# EAGLE design Lightpack_6.0T_man (EAGLE 6.5.0)
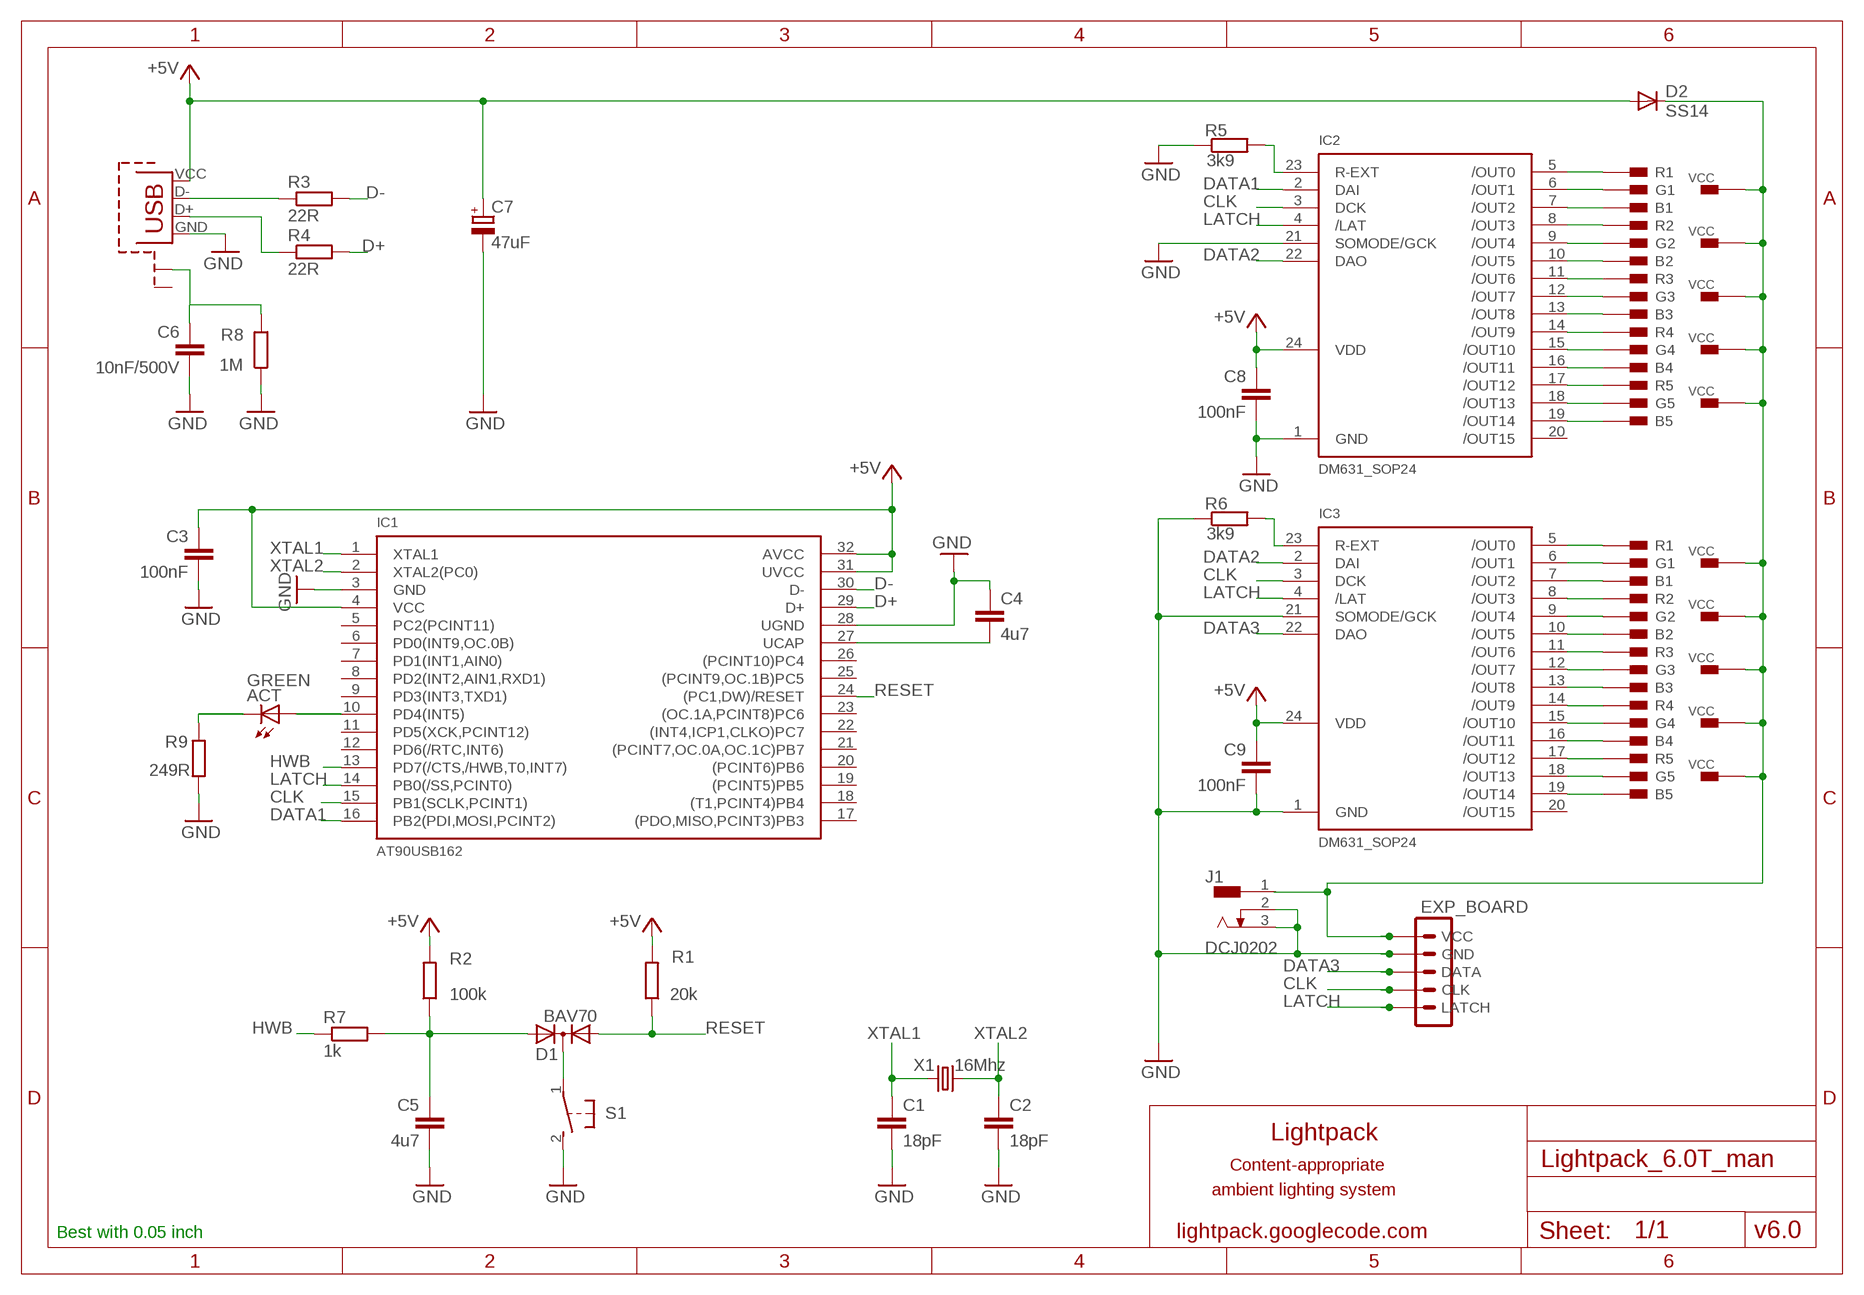
[diagram p0: schematic, sheet 1]

## Parts
ACT  GREEN  LED3MM  [LED3MM]
C1  18pF  C-EUC0805  [C0805]
C2  18pF  C-EUC0805  [C0805]
C3  100nF  C-EUC0805  [C0805]
C4  4u7  C-EUC0805  [C0805]
C5  4u7  C-EUC0805  [C0805]
C6  10nF/500V  C-EUC0805  [C0805]
C7  47uF  CPOL-EUSMCD  [SMC_D]
C8  100nF  C-EUC0805  [C0805]
C9  100nF  C-EUC0805  [C0805]
CN1  USB-MICRO-B-EVT  [USB-MICRO-B-UNIVERSAL-SOLID-FOOTS]
CN2  RJ11-5P-REEL-LIGHTPACK6T2  [RJ11-1XN-5P]
CN3  RJ11-5P-REEL-MAIN  [RJ11-1XN-5P]
D1  BAV70  DIODE-2AC|CASOT23  [SOT23]
D2  SS14  DIODE-SMB  [SMB]
EXP_BOARD  MA05-1  [MA05-1]
IC1  AT90USB162  [TQFP32]
IC2  DM631_SOP24  [SOP24-300-1.27]
IC3  DM631_SOP24  [SOP24-300-1.27]
J1  DCJ0202  [DCJ0202]
R1  20k  R-EU_R0805  [R0805]
R2  100k  R-EU_R0805  [R0805]
R3  22R  R-EU_R0805  [R0805]
R4  22R  R-EU_R0805  [R0805]
R5  3k9  R-EU_R0805  [R0805]
R6  3k9  R-EU_R0805  [R0805]
R7  1k  R-EU_R0805  [R0805]
R8  1M  R-EU_R0805  [R0805]
R9  249R  R-EU_R0805  [R0805]
S1  31-XX  [B3F-31XX]
X1  16Mhz  CRYSTALHC49UP  [HC49UP]

## Nets
+5V [VCC]: C3.1 C7.+ C8.1 C9.1 CN1.VCC(VBUS) D2.A IC1.4(VCC) IC1.31(UVCC) IC1.32(AVCC) IC2.24(VDD) IC3.24(VDD) R1.2 R2.2
CLK: EXP_BOARD.2(CLK) IC1.15(PB1(SCLK,PCINT1)) IC2.3(DCK) IC3.3(DCK)
D+: IC1.29(D+) R4.2
D-: IC1.30(D-) R3.2
DATA1: IC1.16(PB2(PDI,MOSI,PCINT2)) IC2.2(DAI)
DATA2: IC2.22(DAO) IC3.2(DAI)
DATA3: EXP_BOARD.3(DATA) IC3.22(DAO)
GND: C1.2 C2.2 C3.2 C4.1 C5.2 C6.1 C7.- C8.2 C9.2 CN1.GND EXP_BOARD.4(GND) IC1.3(GND) IC1.28(UGND) IC2.1(GND) IC2.21(SOMODE/GCK) IC3.1(GND) IC3.21(SOMODE/GCK) J1.2 J1.3 R5.1 R6.1 R8.1 R9.1 S1.2(S)
HWB: IC1.13(PD7(/CTS,/HWB,T0,INT7)) R7.1
LATCH: EXP_BOARD.1(LATCH) IC1.14(PB0(/SS,PCINT0)) IC2.4(/LAT) IC3.4(/LAT)
N$1: IC2.23(R-EXT) R5.2
N$2: CN3.R2 IC3.8(/OUT3)
N$3: ACT.A IC1.10(PD4(INT5))
N$5: CN2.R5(R1) IC2.5(/OUT0)
N$6: CN2.G5(G1) IC2.6(/OUT1)
N$7: CN2.B5(B1) IC2.7(/OUT2)
N$9: CN2.R4(R2) IC2.8(/OUT3)
N$10: CN2.G4(G2) IC2.9(/OUT4)
N$11: CN2.B4(B2) IC2.10(/OUT5)
N$12: CN2.R1(R3) IC2.11(/OUT6)
N$13: CN2.G1(G3) IC2.12(/OUT7)
N$14: CN2.B1(B3) IC2.13(/OUT8)
N$15: CN2.R2(R4) IC2.14(/OUT9)
N$16: D1.3(C) S1.1(P)
N$17: C4.2 IC1.27(UCAP)
N$18: CN3.R1 IC3.5(/OUT0)
N$19: CN3.G1 IC3.6(/OUT1)
N$20: CN3.B1 IC3.7(/OUT2)
N$21: CN3.G2 IC3.9(/OUT4)
N$22: CN3.B2 IC3.10(/OUT5)
N$23: CN3.R3 IC3.11(/OUT6)
N$24: CN3.G3 IC3.12(/OUT7)
N$25: CN3.R4 IC3.14(/OUT9)
N$26: CN3.B3 IC3.13(/OUT8)
N$27: CN3.G4 IC3.15(/OUT10)
N$28: CN3.B4 IC3.16(/OUT11)
N$29: CN2.G2(G4) IC2.15(/OUT10)
N$30: CN2.B2(B4) IC2.16(/OUT11)
N$31: IC3.23(R-EXT) R6.2
N$32: CN1.D- R3.1
N$33: CN1.D+ R4.1
N$37: ACT.K(C) R9.2
N$38: CN2.R3(R5) IC2.17(/OUT12)
N$39: CN2.G3(G5) IC2.18(/OUT13)
N$40: CN2.B3(B5) IC2.19(/OUT14)
N$41: CN3.R5 IC3.17(/OUT12)
N$42: CN3.G5 IC3.18(/OUT13)
N$43: CN3.B5 IC3.19(/OUT14)
N$44: C6.2 CN1.P$4(SHIELD1) R8.2
N$47: C5.1 D1.2(A2) R2.1 R7.2
N$57 [VCC]: CN2.VCC1(VCC3) CN2.VCC2(VCC4) CN2.VCC3(VCC5) CN2.VCC4(VCC2) CN2.VCC5(VCC1) CN3.VCC1 CN3.VCC2 CN3.VCC3 CN3.VCC4 CN3.VCC5 D2.C EXP_BOARD.5(VCC) J1.1
RESET: D1.1(A1) IC1.24((PC1,DW)/RESET) R1.1
XTAL1: C1.1 IC1.1(XTAL1) X1.1
XTAL2: C2.1 IC1.2(XTAL2(PC0)) X1.2
Unconnected: CN1.P$1(SHIELD2) IC1.5(PC2(PCINT11)) IC1.6(PD0(INT9,OC.0B)) IC1.7(PD1(INT1,AIN0)) IC1.8(PD2(INT2,AIN1,RXD1)) IC1.9(PD3(INT3,TXD1)) IC1.11(PD5(XCK,PCINT12)) IC1.12(PD6(/RTC,INT6)) IC1.17((PDO,MISO,PCINT3)PB3) IC1.18((T1,PCINT4)PB4) IC1.19((PCINT5)PB5) IC1.20((PCINT6)PB6) IC1.21((PCINT7,OC.0A,OC.1C)PB7) IC1.22((INT4,ICP1,CLKO)PC7) IC1.23((OC.1A,PCINT8)PC6) IC1.25((PCINT9,OC.1B)PC5) IC1.26((PCINT10)PC4) IC2.20(/OUT15) IC3.20(/OUT15)

## Notes on the sheet
- Lightpack
- Content-appropriate
- ambient lighting system
- Best with 0.05 inch | lightpack.googlecode.com | v6.0

## Library data of the parts
ACT = adafruit:LED: LED OSRAM: - CHIPLED LG R971, LG N971, LY N971, LG Q971, LY Q971, LO R971, LY R971 LH N974, LH R974 LS Q976, LO Q976, LY Q976 LO Q996 - Hyper CHIPLED LW Q18S LB Q993, LB Q99A, LB R99A - SideLED LS A670, LO A670, LY A670, LG A670, LP A670 LB A673, LV A673, LT A673, LW A673 LH A674 LY A675 LS A676, LA A676, LO A676, LY A676, LW A676 LS A679, LY A679, LG A679 - Hyper Micro SIDELED® LS Y876, LA Y876, LO Y876, LY Y876 LT Y87S - SmartLED LW L88C, LW L88S LB L89C, LB L89S, LG L890 LS L89K, LO L89K, LY L89K LS L896, LA L896, LO L896, LY L896 - TOPLED LS T670, LO T670, LY T670, LG T670, LP T670 LSG T670, LSP T670, LSY T670, LOP T670, LYG T670 LG T671, LOG T671, LSG T671 LB T673, LV T673, LT T673, LW T673 LH T674 LS T676, LA T676, LO T676, LY T676, LB T676, LH T676, LSB T676, LW T676 LB T67C, LV T67C, LT T67C, LS T67K, LO T67K, LY T67K, LW E67C LS E67B, LA E67B, LO E67B, LY E67B, LB E67C, LV E67C, LT E67C LW T67C LS T679, LY T679, LG T679 LS T770, LO T770, LY T770, LG T770, LP T770 LB T773, LV T773, LT T773, LW T773 LH T774 LS E675, LA E675, LY E675, LS T675 LS T776, LA T776, LO T776, LY T776, LB T776 LHGB T686 LT T68C, LB T68C - Hyper Mini TOPLED® LB M676 - Mini TOPLED Santana® LG M470 LS M47K, LO M47K, LY M47K Source: http://www.osram.convergy.de/
C1-C6 C8 C9 = rcl:C-EU: CAPACITOR, European symbol
C7 = rcl:CPOL-EU: POLARIZED CAPACITOR, European symbol
CN1 = _USB_sockets:USB-MICRO-B: USB MICRO B SOCKET 2 shielded pins
CN2 CN3 = _RJ11:RJ11-5P-REEL: RJ11 5P REEL RJ11 1XN 5P assembly by CZT
D1 = diode:DIODE-2AC|CA: Dual DIODE Anode-Cathode|Cathode-Anode
D2 = diode:DIODE-: DIODE
EXP_BOARD = brd-conn:MA05-1: PIN HEADER
IC1 = AT90USB:AT90USB162: AT90USB162 Author: brunql.github.com
IC2 IC3 = _LedDrivers:DM631: DM631 Author: brunql.github.com
J1 = _connectors:DCJ0202: DC POWER JACK Source: DCJ0202.pdf !DO NOT FORGET MILLING LAYER CAUSE HOLES ARE NOT ROUND!; OC_FARNELL: unknown; OC_NEWARK: unknown
R1-R9 = rcl:R-EU_: RESISTOR, European symbol
S1 = _switches:31-XX: OMRON SWITCH Now with beefier pads!
X1 = crystal:CRYSTAL: CRYSTAL; OC_FARNELL: unknown; OC_NEWARK: unknown

## Net classes
1 VCC: width 0.6 mm, clearance 0.6 mm

## Board
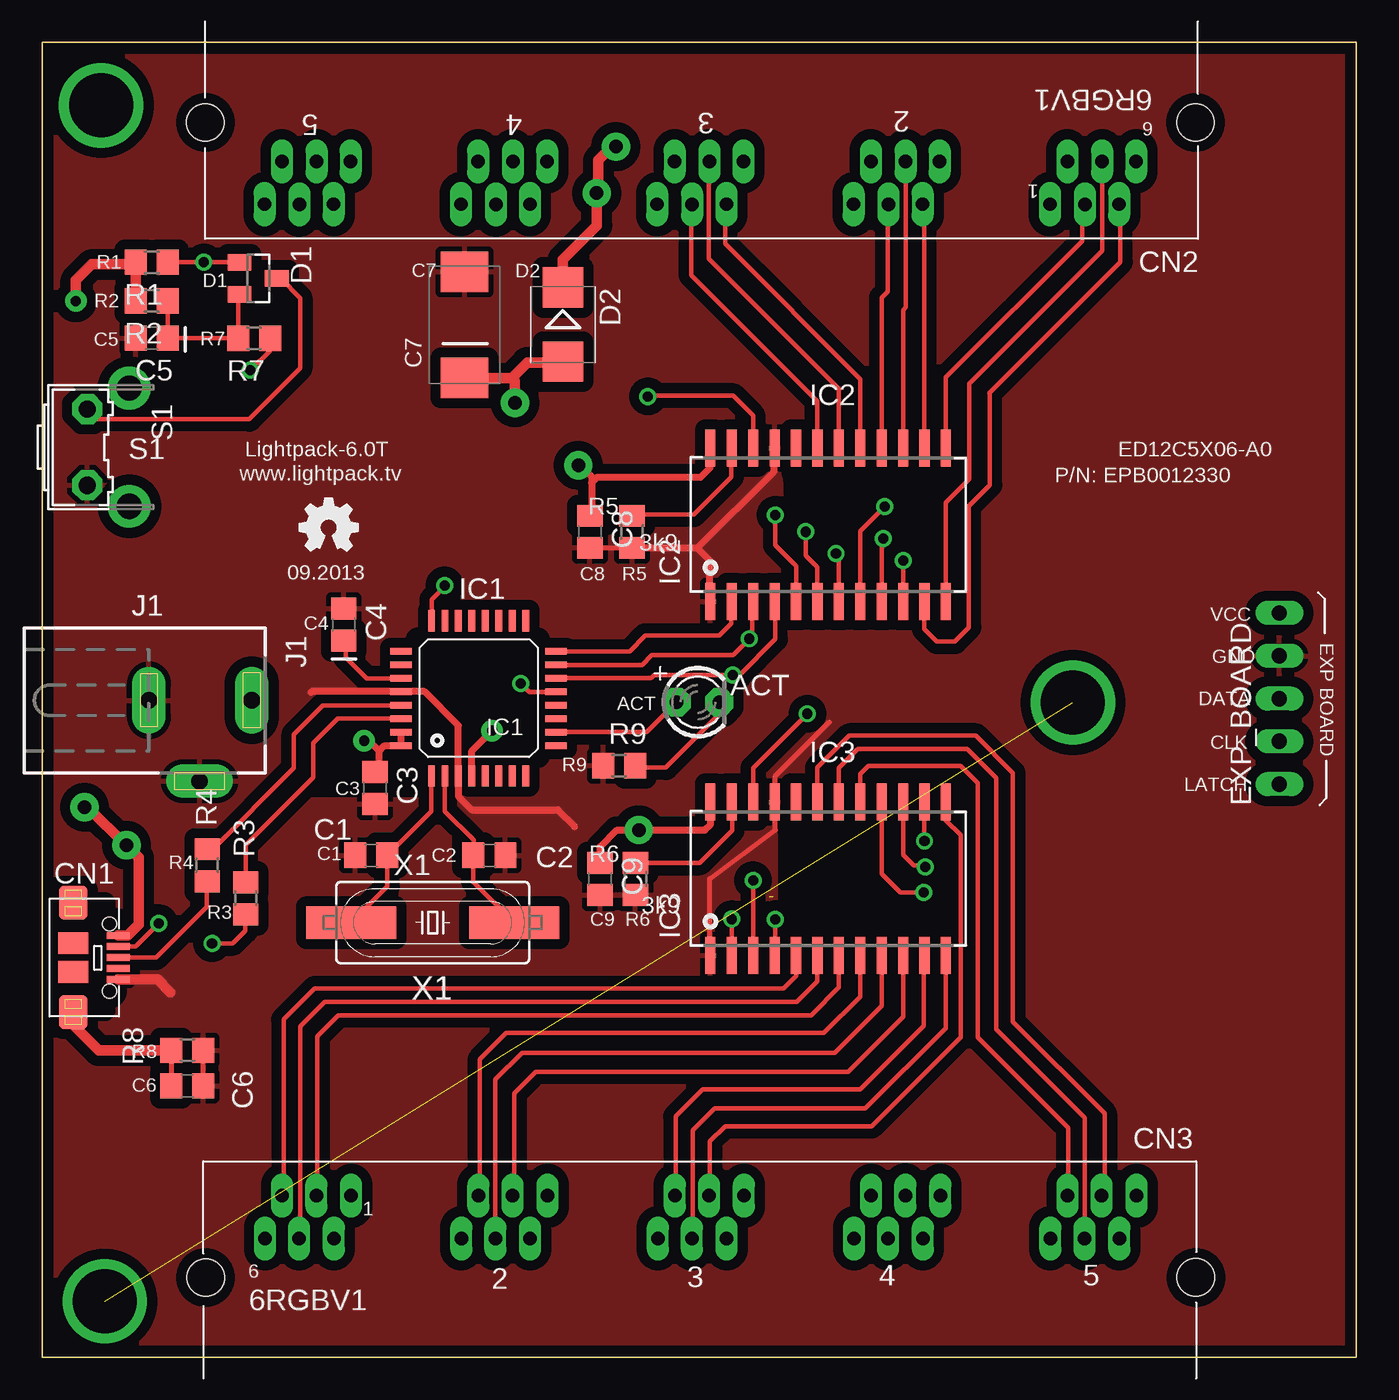
[diagram p1: board, top side]
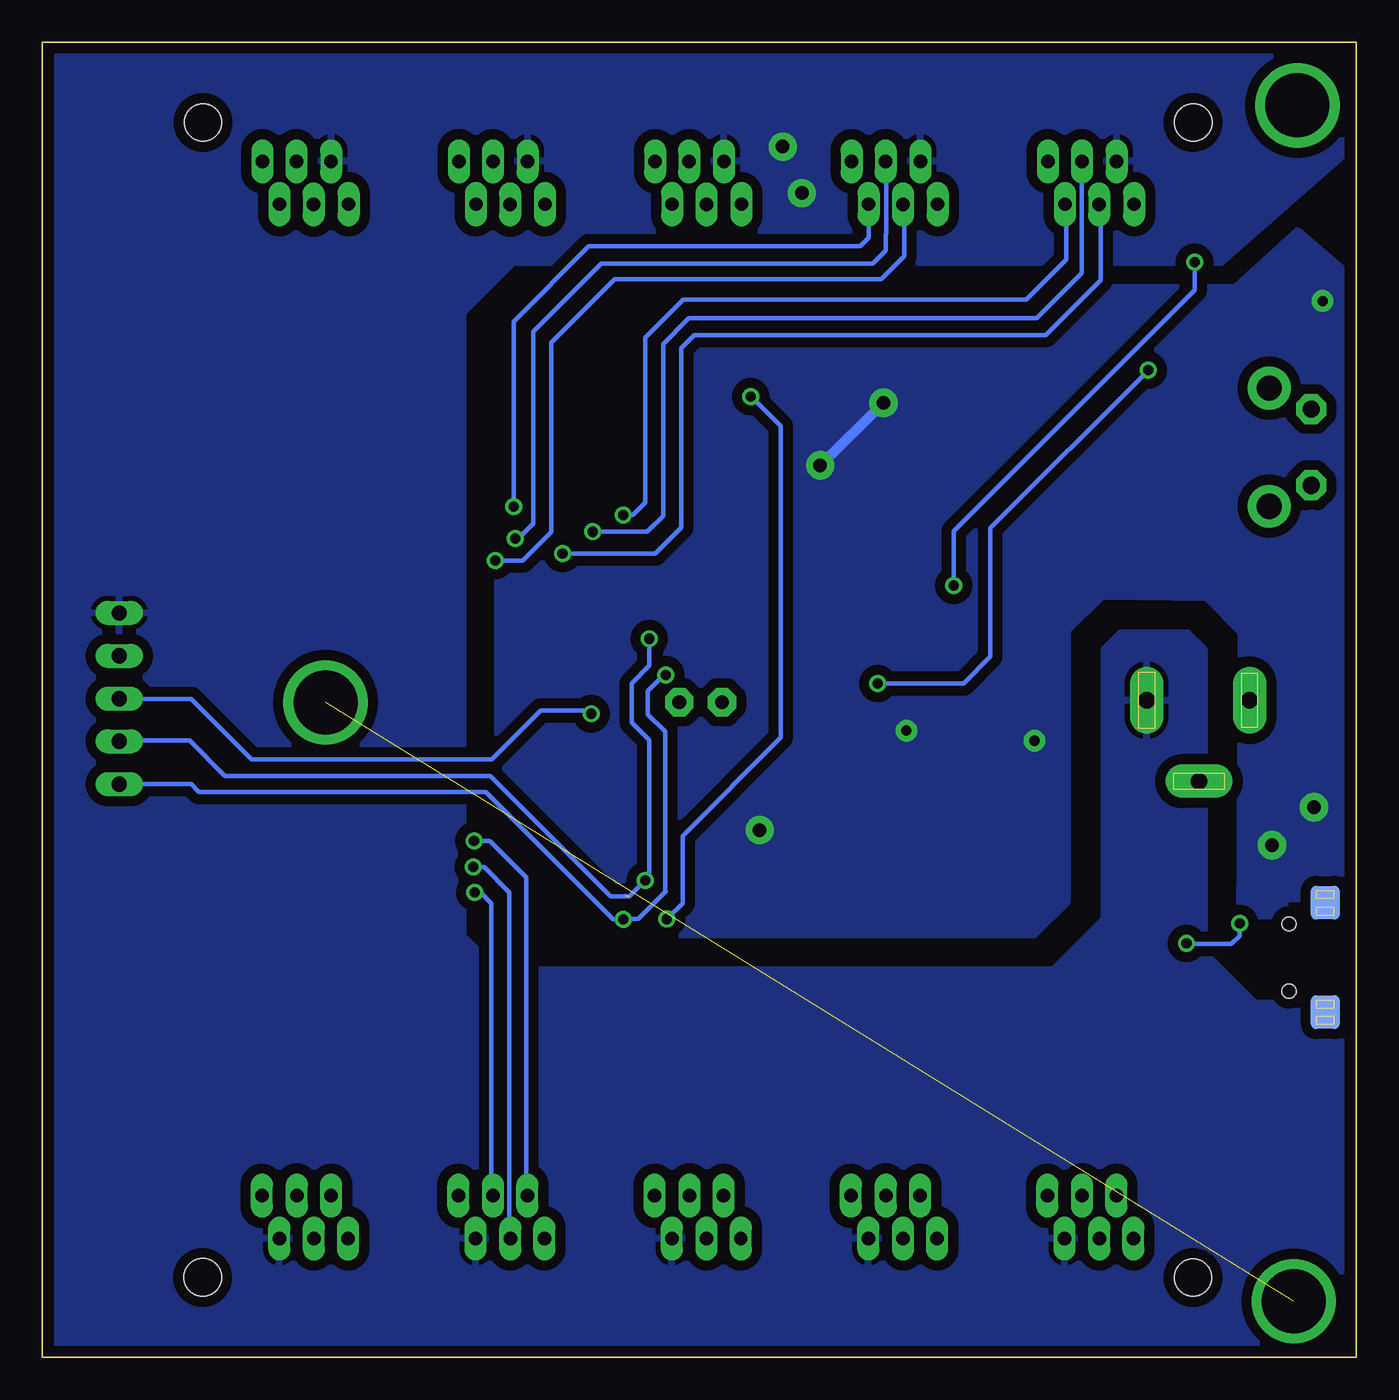
[diagram p2: board, bottom side, seen from below]

Size 77.97 x 78.06 mm. Coordinates in mm from the lower left corner, seen from the top.
Outline: 0,0 0,78.06 77.97,78.06 77.97,0 0,0
Copper layers (1*16): Top 0.035mm / dielectric 1.5mm / Bottom 0.035mm
Design rules "default *": minimum track width 10mil, minimum drill 24mil, track to track 8mil, track to pad 8mil, pad to pad 8mil, via to via 8mil, smd to smd 8mil, copper to edge 25mil, drill to drill 8mil, minimum pad ring 10mil, minimum via ring 8mil, stop-mask expansion 4mil, vias tented up to drill 0.6mm, thermal gap 12mil
tRestrict: area 22.3,35.7 to 29.4,42.6; area 16,34 to 22.2,36.6; area 44.6,46.4 to 53.3,52.5; area 44.4,25.4 to 53.8,31.7; area 0,20.5 to 3.7,27
bRestrict: area 0,22 to 4,27; area 4,23 to 6,26

### Footprints (pad centres in the part's own frame; a part is rotated, then mirrored left to right if it is on the bottom)
LED3MM = drill 0.813 pad 1.676 octagon: A -1.27,0; K 1.27,0
C0805 = smd 1.3 x 1.5: 1 -0.95,0; 2 0.95,0
SMC_D = smd 2.4 x 2.8: + -3.15,0; - 3.15,0
USB-MICRO-B-UNIVERSAL-SOLID-FOOTS = smd 0.4 x 1.35: D+ 0,-0.03; D- -0.65,-0.03; GND 1.3,-0.03; ID 0.65,-0.03; VCC -1.3,-0.03 | smd 2 x 1.7 bottom: P$1 -3.25,-2.7; P$5 3.25,-2.7 | smd 1.3 x 1.8: P$2 -0.85,-2.7; P$6 0.85,-2.7 | smd 2 x 1.7: P$3 -3.25,-2.7; P$4 3.25,-2.7 | hole 0.8: -2,-0.55; 2,-0.55
RJ11-1XN-5P = drill 0.8 pad 1.118 long: B1 -21.794,2.566; B2 -10.144,2.566; B3 1.506,2.566; B4 13.156,2.566; B5 24.806,2.566; G1 -22.814,0.006; G2 -11.164,0.006; G3 0.486,0.006; G4 12.136,0.006; G5 23.786,0.006; P$3 3.576,2.546; P$4 -1.534,0.006; P$9 -8.074,2.546; P$10 -13.184,0.006; P$15 -19.724,2.546; P$16 -24.834,0.006; P$21 26.876,2.546; P$22 21.766,0.006; P$27 15.226,2.546; P$28 10.116,0.006; R1 -23.824,2.546; R2 -12.174,2.546; R3 -0.524,2.546; R4 11.126,2.546; R5 22.776,2.546; VCC1 -20.754,0.006; VCC2 -9.104,0.006; VCC3 2.546,0.006; VCC4 14.196,0.006; VCC5 25.846,0.006 | hole 2.2: 30.39,-2.3; -28.36,-2.31
SOT23 = smd 1 x 1.4: 1 -0.95,-1.1; 2 0.95,-1.1; 3 0,1.1
SMB = smd 2.4 x 2.4: A 2.2,0; C -2.2,0
MA05-1 = drill 0.914 long: 1 -5.08,0; 2 -2.54,0; 3 0,0; 4 2.54,0; 5 5.08,0
TQFP32 = smd 1.27 x 0.4: 1 -4.61,2.82; 2 -4.61,2.02; 3 -4.61,1.22; 4 -4.61,0.42; 5 -4.61,-0.38; 6 -4.61,-1.18; 7 -4.61,-1.98; 8 -4.61,-2.78; 17 4.59,-2.78; 18 4.59,-1.98; 19 4.59,-1.18; 20 4.59,-0.38; 21 4.59,0.42; 22 4.59,1.22; 23 4.59,2.02; 24 4.59,2.82 | smd 0.4 x 1.27: 9 -2.81,-4.58; 10 -2.01,-4.58; 11 -1.21,-4.58; 12 -0.41,-4.58; 13 0.39,-4.58; 14 1.19,-4.58; 15 1.99,-4.58; 16 2.79,-4.58; 25 2.79,4.62; 26 1.99,4.62; 27 1.19,4.62; 28 0.39,4.62; 29 -0.41,4.62; 30 -1.21,4.62; 31 -2.01,4.62; 32 -2.81,4.62
SOP24-300-1.27 = smd 0.6 x 2.2: 1 -6.85,-4.635; 2 -5.58,-4.635; 3 -4.31,-4.635; 4 -3.04,-4.635; 5 -1.77,-4.635; 6 -0.5,-4.635; 7 0.77,-4.635; 8 2.04,-4.635; 9 3.31,-4.635; 10 4.58,-4.635; 11 5.85,-4.635; 12 7.12,-4.635; 13 7.12,4.47; 14 5.85,4.47; 15 4.58,4.47; 16 3.31,4.47; 17 2.04,4.47; 18 0.77,4.47; 19 -0.5,4.47; 20 -1.77,4.47; 21 -3.04,4.47; 22 -4.31,4.47; 23 -5.58,4.47; 24 -6.85,4.47
DCJ0202 = drill 1 pad 2 long: 1 0,3.1; 2 4.8,0; 3 0,-3
R0805 = smd 1.3 x 1.5: 1 -0.95,0; 2 0.95,0
B3F-31XX = drill 1.016 pad 1.778 octagon: 1 -2.261,-1.245; 2 2.261,-1.245 | drill 1.499 pad 2.54: 3 -3.505,1.245; 4 3.505,1.245
HC49UP = smd 5.334 x 1.93: 1 -4.826,0; 2 4.826,0

### Placement (x,y rotation side)
ACT  38.91,38.89 0 top
C1  19.54,29.8 180 top
C2  26.54,29.8 0 top
C3  19.75,33.8 270 top
C4  17.9,43.5 270 top
C5  6.5,60.5 180 top
C6  8.62,16.11 180 top
C7  25.06,61.28 90 top
C8  32.5,49 270 top
C9  33.1,28.4 270 top
CN1  4.55,23.73 270 top
CN2  40.07,70.99 180 top
CN3  38.06,7.05 0 top
D1  12.82,64.04 270 top
D2  30.9,61.3 270 top
EXP_BOARD  73.4,39.1 90 top
IC1  25.91,39.12 90 top
IC2  46.5,49.5 0 top
IC3  46.5,28.5 0 top
J1  9.34,39 270 top
R1  6.5,65 180 top
R2  6.5,62.7 180 top
R3  12.08,27.25 90 top
R4  9.79,29.21 90 top
R5  35,49 90 top
R6  35.2,28.4 90 top
R7  12.57,60.48 180 top
R8  8.62,18.23 180 top
R9  34.23,35.12 0 top
S1  3.93,54.02 270 top
X1  23.18,25.81 0 top

### Tracks (layer width: path | path; a pad name or v marks a point on that pad's centre or on a via)
+5V  (via drill 0.6 pad 1.27, 0.8 pad 1.68)
  Top 0.305: C3.1 20,35 | IC1.31 21.3,37.1 | 39.62,54 IC2.24 39.7,54.02
  Top 0.406: IC1.31 IC1.32 20.31,36.31 20,36 | 20,35 20,36 | v19.1,36.6 19.5,36.5 20,36 | IC1.4 25.5,35.99 v26.7,37.2 | C9.1 33.1,30.3 34.1,31.3 v35.4,31.3 39.32,31.3 39.66,31.64 39.66,32.2 39.67,32.21 39.67,32.95 IC3.24 | v31.81,52.95 31.92,52.95 32.6,52.27 32.6,51.92 | 32.6,51.92 32.6,50.05 C8.1 | 39.62,54 39.62,52.79 39.06,52.23 32.91,52.23 32.6,51.92
  Top 0.61: v2,62.7 2,63.93 2.95,64.88 5.43,64.88 R1.2 R2.2 | C7.+ 27.85,58.13 | 27.85,58.13 28.77,59.05 30.85,59.05 D2.A | v28.05,56.65 28.05,57.93 27.85,58.13 | CN1.VCC 5.07,25.04 5.73,25.7 5.73,29.67 v5,30.4 | v2.51,32.65 2.72,32.65 4.99,30.38
  Bottom 0.61: v28.05,56.65 v31.81,52.95
  pour Bottom: 0,64 0,23 4.99,23 6.99,25.02 6.89,42.99 8.88,45 15.08,45.11 17.1,43.11 17.1,27 19.1,25 49,25 51,27 51,60.59 48,63.59 7.21,63.59 3.47,66.99
CLK  (via drill 0.6)  (1 unrouted)
  Top 0.254: IC3.3 v42.19,28.31 | IC1.15 35.6,41.11 36.18,41.69 40.99,41.69 v41.95,42.65 42.13,42.83 42.13,44.8 IC2.3
  Top 0.305: IC2.3 42.19,45.69
  Bottom 0.254: 41.95,28.55 v42.19,28.31 | v42.19,28.31 42.19,28.28 | v42.19,28.31 43.14,27.36 44.24,27.36 51.38,34.5 67.13,34.5 69.23,36.6 73.36,36.6 EXP_BOARD.2 73.38,36.58 | 43.38,27.36 43.38,27.38 | v41.95,42.65 41.95,41.05 43,40 43,37.68 41.96,36.64 41.96,28.54 v42.19,28.31 | 42,28.5 v42.19,28.31
D+
  Top 0.254: 21.27,38.68 IC1.29 21.27,38.68 | R4.2 10.12,30.16 14.94,34.98 14.94,36.98 16.64,38.68 21.27,38.68
  Top 0.305: IC1.29
D-
  Top 0.254: R3.2 12.08,30.42 16.09,34.43 16.09,36.47 17.54,37.92 IC1.30
DATA1
  Top 0.254: 40.88,44.83 IC2.2 40.89,44.84 40.89,43.55 40.17,42.83 35.78,42.83 34.86,41.91 IC1.16
  Top 0.305: 40.9,44.84 IC2.2
DATA2  (via drill 0.6)
  Top 0.254: v40.92,26.01 IC3.2 | IC2.22 42.19,55.89 41.01,57.07 35.98,57.07 v35.94,57.03
  Top 0.305: 40.92,23.92 IC3.2 41,23.79
  Bottom 0.254: v35.94,57.03 35.89,57.03 34.14,55.28 34.14,36.78 39.98,30.94 39.98,26.95 v40.92,26.01
DATA3  (via drill 0.6)
  Top 0.254: IC3.22 42.19,34.99 v45.4,38.2
  Bottom 0.254: v45.4,38.2 45.4,38.4 48.36,38.4 48.38,38.4 51.3,35.48 65.53,35.48 69.14,39.09 EXP_BOARD.3 | EXP_BOARD.3
GND
  Top 0.305: C6.1 R8.1 | C3.2 19.8,32.8 | IC3.1 39.6,25.91 39.6,28.4 43.5,31.3 43.5,32.93 | 43.5,32.93 IC3.21 | 43.5,32.93 43.5,34.5 46.7,37.7 | 32.45,48 C8.2 R5.1 | IC2.1 39.6,44.91 | 43.4,53.91 IC2.21 | IC1.3
  Top 0.406: IC1.3 24.7,33.3 25.5,32.5 30.6,32.5 31.6,31.5 | IC1.3 24.7,37.5 22.69,39.51 IC1.28 15.98,39.51 15.96,39.49 | 9.52,18.27 R8.1 | 43.4,53.91 43.4,52.54 38.88,48.02 | 38.88,48.02 35.03,48.02 R5.1 | 39.6,44.91 39.6,47.3 38.88,48.02
  Top 0.61: CN1.GND 6.84,22.43 7.61,21.67 | 9.61,18.27 R8.1
  pour Top (isolate 0.61): 0,78 78,78 78,0 0,0
HWB  (via drill 0.6)
  Top 0.254: IC1.13 28.9,39.5 v28.4,40 | R7.1 13.53,59.77 v12.35,58.59
  Top 0.305: IC1.13
  Bottom 0.254: v28.4,40 23.3,40 21.71,41.59 21.71,49.21 12.35,58.57 v12.35,58.59
LATCH  (via drill 0.6)
  Top 0.254: IC3.4 43.5,25.91 | 43.42,44.83 IC2.4 43.5,44.83 43.5,42.63 41.38,40.51 v40.97,40.51 38.06,40.5 36.33,40.5 36.14,40.31 IC1.14
  Top 0.305: 43.5,25.91 v43.5,26 | 43.5,44.6 43.5,45.42 43.46,45.46 IC2.4 43.4,44.8
  Bottom 0.254: EXP_BOARD.1 69.14,34.03 68.68,33.57 51.66,33.57 44.09,26 v43.5,26 v43.49,26.01 42.6,26.01 40.97,27.64 41.02,27.69 41.02,37.14 42.03,38.15 42.03,39.56 41.08,40.51 v40.97,40.51
N$1
  Top 0.254: 40.9,53.95 40.9,52.26 38.66,50.02 35.07,50.02 R5.2
  Top 0.305: 40.9,53.95 IC2.23
N$2
  Top 0.254: IC3.8 48.54,21.94 48.54,21.41 46.38,19.25 27.54,19.25 25.97,17.68 25.97,9.79 CN3.R2
N$3
  Top 0.254: IC1.10 35.86,37.11 ACT.A
N$5  (via drill 0.6)
  Top 0.254: IC2.5 44.73,46.97 43.5,48.2 v43.5,50
  Bottom 0.254: v43.5,50 42.93,50 42.2,50.73 42.2,60.51 39.94,62.77 19.58,62.77 17.21,65.14 17.21,68.24 CN2.R5
N$6  (via drill 0.6)
  Top 0.254: IC2.6 46,46.9 45.3,47.6 v45.3,49
  Bottom 0.254: v45.3,49 42.06,49 41.13,49.93 41.13,60.15 39.6,61.68 18.96,61.68 16.28,64.36 CN2.G5
N$7  (via drill 0.6)
  Top 0.254: IC2.7 47.27,47.53 v47.1,47.7
  Bottom 0.254: v47.1,47.7 42.56,47.7 41.61,47.7 40.06,49.25 40.06,59.89 39.28,60.67 18.42,60.67 15.16,63.93 15.16,65.66 15.16,68.2 CN2.B5
N$9  (via drill 0.6)
  Top 0.254: IC2.8 48.54,49.04 v50,50.5
  Bottom 0.254: v50,50.5 50,61.48 45.53,65.95 29.44,65.95 28.94,66.45 28.94,68.19 CN2.R4
N$10  (via drill 0.6)
  Top 0.254: 49.81,48.51 IC2.9
  Top 0.305: v49.9,48.6 49.81,48.51
  Bottom 0.254: v49.9,48.6 49.73,48.6 48.83,49.5 48.83,60.88 44.79,64.92 28.98,64.92 28.68,64.92 27.91,65.69 27.91,66.66 27.9,66.67 27.9,70.76 CN2.G4
N$11  (via drill 0.6)
  Top 0.254: 51.08,47.28 IC2.10
  Top 0.305: IC2.10 51.08,44.58 | v51.1,47.3 51.08,47.28
  Bottom 0.254: v51.1,47.3 49.45,47.3 47.76,48.99 47.76,60.24 44,64 28.2,64 26.84,65.36 26.84,68.23 CN2.B4
N$12
  Top 0.254: IC2.11 52.35,43.22 53.09,42.48 54.15,42.48 54.99,43.32 54.99,50.54 56.23,51.78 56.23,57.19 56.19,57.23 63.97,65.01 63.97,68.11 CN2.R1
N$13
  Top 0.254: IC2.12 53.62,50.74 55,52.12 55,57.8 62.88,65.68 CN2.G1
N$14
  Top 0.254: IC2.13 53.62,58.17 61.7,66.25 61.7,68.14 CN2.B1
N$15
  Top 0.254: IC2.14 52.35,68.08 CN2.R2
N$16
  Top 0.254: D1.3 14.15,64.04 15.31,62.88 15.31,58.7 12.29,55.68 3.29,55.68 S1.1
N$17
  Top 0.254: IC1.27 19.25,40.3 18.01,41.54 18.01,42.44 C4.2
  Top 0.305: IC1.27
N$18
  Top 0.254: IC3.5 44.73,22.63 44,21.9 16.18,21.9 14.33,20.05 14.33,9.8 CN3.R1
N$19
  Top 0.254: IC3.6 46,22.32 44.78,21.1 16.76,21.1 15.31,19.65 15.31,7.23 CN3.G1
N$20
  Top 0.254: IC3.7 47.27,21.95 45.62,20.3 17.57,20.3 16.33,19.06 16.33,9.79 CN3.B1
  Top 0.305: IC3.7 47.27,23.27
N$21
  Top 0.254: IC3.9 49.81,20.86 47.03,18.08 28.48,18.08 26.9,16.5 CN3.G2
N$22
  Top 0.254: IC3.10 51.08,21.78 51.08,20.2 47.83,16.95 29.28,16.95 28.01,15.68 28.01,9.82 CN3.B2
N$23
  Top 0.254: 52.3,23.82 52.3,21.7 52.3,19.67 48.53,15.9 39.18,15.9 37.58,14.3 37.58,9.75 CN3.R3
  Top 0.305: 52.35,23.85 IC3.11 52.3,23.82
N$24
  Top 0.254: 53.6,23.84 53.6,21.5 53.6,19.52 48.85,14.77 39.9,14.77 38.59,13.46 38.59,7.21 CN3.G3
  Top 0.305: 53.62,24.12 IC3.12 53.6,23.84
N$25  (via drill 0.6)
  Top 0.254: v52.35,30.65 IC3.14
  Bottom 0.254: v52.35,30.65 51.41,30.65 49.26,28.5 49.26,9.78 CN3.R4
N$26
  Top 0.254: 53.62,31.88 54.5,31 54.5,20.6 54.5,19 49.22,13.72 40.52,13.72 39.61,12.81 39.61,9.77 CN3.B3
  Top 0.305: 53.62,31.88 IC3.13
N$27  (via drill 0.6)
  Top 0.254: IC3.15 51.08,29.82 51.7,29.2 52.3,29.2 v52.4,29.1
  Bottom 0.254: v52.4,29.1 51.75,29.1 50.25,27.6 50.25,7.22 CN3.G4
N$28  (via drill 0.6)
  Top 0.254: IC3.16 49.81,28.69 50.9,27.6 v52.3,27.6 v52.31,27.59
  Bottom 0.254: v52.31,27.59 51.96,27.59 51.32,26.95 51.32,9.83 CN3.B4
N$29
  Top 0.254: IC2.15 51.08,62.17 51.24,62.33 51.24,70.72 CN2.G2
N$30
  Top 0.254: IC2.16 49.81,62.91 50.16,63.26 50.16,68.22 CN2.B2
N$31
  Top 0.254: R6.2 39.02,29.35 40.94,31.27 40.94,32.95 IC3.23
  Top 0.305: 40.92,33.92 IC3.23 40.9,32.95
N$32  (via drill 0.6)
  Top 0.254: CN1.D- 5.55,24.39 v6.93,25.76 | v10.08,24.57 11.32,24.57 12.06,25.31 12.06,26.28 R3.1
  Bottom 0.254: v10.07,24.56 v10.08,24.57 10.04,24.53 7.41,24.53 6.93,25.01 v6.93,25.76
N$33
  Top 0.254: CN1.D+ 6.76,23.73 9.76,26.73 9.76,28.23 R4.1
N$34  (via drill 3.8 pad 5)
  other vias: 3.5,74.31
N$35  (via drill 3.8 pad 5)  (1 unrouted)
  other vias: 3.71,3.33 61.16,38.87
N$37
  Top 0.254: ACT.K 40.18,38.18 37,35 35.3,35 R9.2
N$38
  Top 0.254: IC2.17 48.54,58.07 40.52,66.09 40.52,68.25 CN2.R3
N$39
  Top 0.254: IC2.18 47.27,57.49 39.54,65.22 39.54,70.77 CN2.G3
N$40
  Top 0.254: IC2.19 46,56.75 38.51,64.24 38.51,68.22 CN2.B3
N$41
  Top 0.254: IC3.17 48.54,34.64 49,35.1 54.5,35.1 55.5,34.1 55.5,19.12 55.5,19 60.89,13.61 60.89,9.76 CN3.R5
N$42
  Top 0.254: IC3.18 47.27,34.97 48.4,36.1 54.9,36.1 56.6,34.4 56.6,19.47 61.85,14.22 CN3.G5
N$43
  Top 0.254: IC3.19 46,35 47.9,36.9 55.4,36.9 57.6,34.7 57.6,19.92 63.04,14.48 63.04,9.9 CN3.B5
N$44
  Top 0.305: R8.2 C6.2
  Top 0.406: 7.64,18.25 R8.2
  Top 0.61: 7.53,18.37 R8.2 3.35,18.22 1.85,19.72 CN1.P$4
N$47
  Top 0.254: R2.1 C5.1 11.61,60.5 R7.2 11.62,63 D1.2
N$57  (via drill 0.8 pad 1.68)
  Top 0.61: D2.C 30.9,65.16 32.91,67.17 v32.91,69.09 | v32.91,69.09 v32.9,69.1 v32.91,69.09 | v34.04,71.86 33.82,71.86 33,71.04 33,69.15 32.87,69.02
  pour Bottom (isolate 0.406): 53,25 53,62 50,65 8,65 0,72 0,78 78,78 78,0 0,0 0.1,19.1 2,21 6,21 9,24 9,42 10,43 14,43 15,42 15,26 18,23 51,23
RESET  (via drill 0.6)
  Top 0.254: R1.1 v9.6,65 D1.1 | v23.88,45.82 23.88,45.75 23.12,44.99 23.12,43.73 IC1.24
  Bottom 0.254: v9.6,65 9.6,63.33 23.9,49.03 23.9,45.84 v23.88,45.82
XTAL1
  Top 0.254: IC1.1 23.09,32.41 C1.1 20.48,27.94 X1.1
XTAL2
  Top 0.254: IC1.2 23.89,32.41 25.6,30.7 C2.1 25.59,28.22 X1.2

### Text on the board
tPlace: R1 | D1 | C7 | D2 | R2 | C5 | R7 | IC2 | S1 | Lightpack-6.0T | ED12C5X06-A0 | www.lightpack.tv | P/N: EPB0012330 | 09.2013 | C8 | R5 | IC1 | J1 | VCC | C4 | EXP BOARD | GND | DATA | ACT | CLK | R9 | IC3 | LATCH | C3 | C1 | R4 | C2 | CN1 | R3 | C9 | R6 | X1 | R8 | C6
tTest: C:/Users/Panda/Desktop/Untitled-1.bmp | C:/Users/Panda/Desktop/Untitled-1.bmp | C:/Users/Panda/Desktop/Untitled-1.bmp